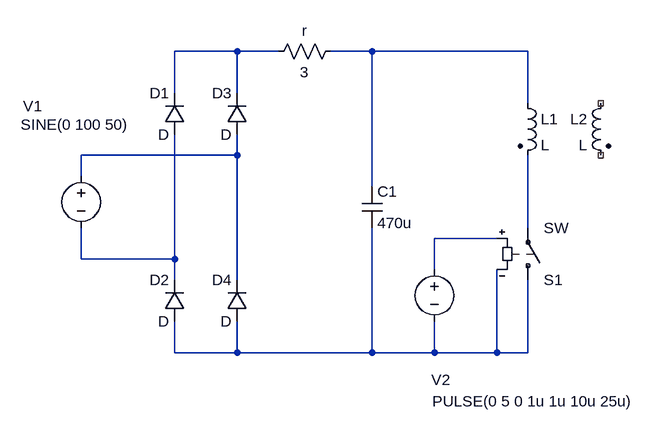
[diagram p0: schematic forward_converter.asc]
forward_converter.asc, the LTspice schematic file:
Version 4
SHEET 1 880 680
WIRE -160 -80 -256 -80
WIRE -96 -80 -160 -80
WIRE 48 -80 -16 -80
WIRE 288 -80 48 -80
WIRE -256 -16 -256 -80
WIRE -160 -16 -160 -80
WIRE 288 0 288 -80
WIRE -160 80 -160 48
WIRE -160 80 -400 80
WIRE -400 112 -400 80
WIRE 48 128 48 -80
WIRE 288 192 288 80
WIRE 240 208 144 208
WIRE -400 240 -400 192
WIRE -256 240 -256 48
WIRE -256 240 -400 240
WIRE 144 256 144 208
WIRE -256 272 -256 240
WIRE -160 272 -160 80
WIRE -256 384 -256 336
WIRE -160 384 -160 336
WIRE -160 384 -256 384
WIRE 48 384 48 192
WIRE 48 384 -160 384
WIRE 144 384 144 336
WIRE 144 384 48 384
WIRE 240 384 240 256
WIRE 240 384 144 384
WIRE 288 384 288 272
WIRE 288 384 240 384
SYMBOL voltage -400 96 R0
WINDOW 0 -89 -92 Left 2
WINDOW 3 -93 -63 Left 2
WINDOW 123 0 0 Left 2
WINDOW 39 0 0 Left 2
SYMATTR InstName V1
SYMATTR Value SINE(0 100 50)
SYMBOL diode -240 48 R180
WINDOW 0 24 64 Left 2
WINDOW 3 24 0 Left 2
SYMATTR InstName D1
SYMBOL diode -240 336 R180
WINDOW 0 24 64 Left 2
WINDOW 3 24 0 Left 2
SYMATTR InstName D2
SYMBOL diode -144 48 R180
WINDOW 0 24 64 Left 2
WINDOW 3 24 0 Left 2
SYMATTR InstName D3
SYMBOL diode -144 336 R180
WINDOW 0 24 64 Left 2
WINDOW 3 24 0 Left 2
SYMATTR InstName D4
SYMBOL res 0 -96 R90
WINDOW 0 0 56 VBottom 2
WINDOW 3 32 56 VTop 2
SYMATTR InstName r
SYMATTR Value 3
SYMATTR SpiceLine tol=5 pwr=1k
SYMBOL cap 32 128 R0
SYMATTR InstName C1
SYMATTR Value 470u
SYMATTR SpiceLine V=300 Irms=10 Rser=3 Lser=10n
SYMBOL sw 288 288 M180
SYMATTR InstName S1
SYMBOL voltage 144 240 R0
WINDOW 0 -5 186 Left 2
WINDOW 3 -3 219 Left 2
WINDOW 123 0 0 Left 2
WINDOW 39 0 0 Left 2
SYMATTR InstName V2
SYMATTR Value PULSE(0 5 0 1u 1u 10u 25u)
SYMBOL ind2 272 -16 R0
SYMATTR InstName L1
SYMBOL ind2 416 -16 M0
SYMATTR InstName L2

The netlist it stands for:
* forward_converter.asc
V1 N003 N006 SINE(0 100 50)
D1 N006 N001 D
D2 N007 N006 D
D3 N003 N001 D
D4 N007 N003 D
r N002 N001 3 tol=5 pwr=1k
C1 N002 N007 470u V=300 Irms=10 Rser=3 Lser=10n
S1 N007 N004 N005 N007 SW
V2 N005 N007 PULSE(0 5 0 1u 1u 10u 25u)
L1 N002 N004 L
L2 NC_01 NC_02 L
.model D D
.lib standard.dio
.backanno
.end